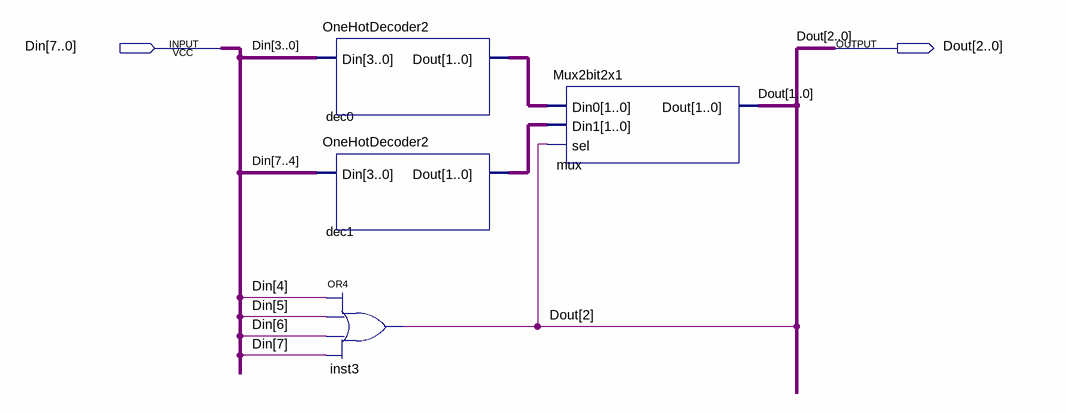
[diagram p0: schematic sheet]
// Quartus schematic OneHotDecoder3.bdf as structural Verilog: 4 symbols, 2 pins
module OneHotDecoder3 (
  input  [7:0] Din,
  output [2:0] Dout
);

  wire [1:0] dec0_dout, dec1_dout;

  OneHotDecoder2 dec0 (.Din(Din[3:0]), .Dout(dec0_dout));
  OneHotDecoder2 dec1 (.Din(Din[7:4]), .Dout(dec1_dout));
  or inst3 (Dout[2], Din[4], Din[5], Din[6], Din[7]);
  Mux2bit2x1 mux (.Din0(dec0_dout), .Din1(dec1_dout), .sel(Dout[2]), .Dout(Dout[1:0]));
endmodule
